# Altium schematic sheet MF-CI.4.2-SDW - EXTERNAL.SchDoc
size A3; Organization: Altium Limited; Address1: L3, 12a Rodborough Rd; Address2: Frenchs Forest; Address3: NSW; Address4: Australia 2086; DocumentNumber: 1; SheetNumber: 1; SheetTotal: 1
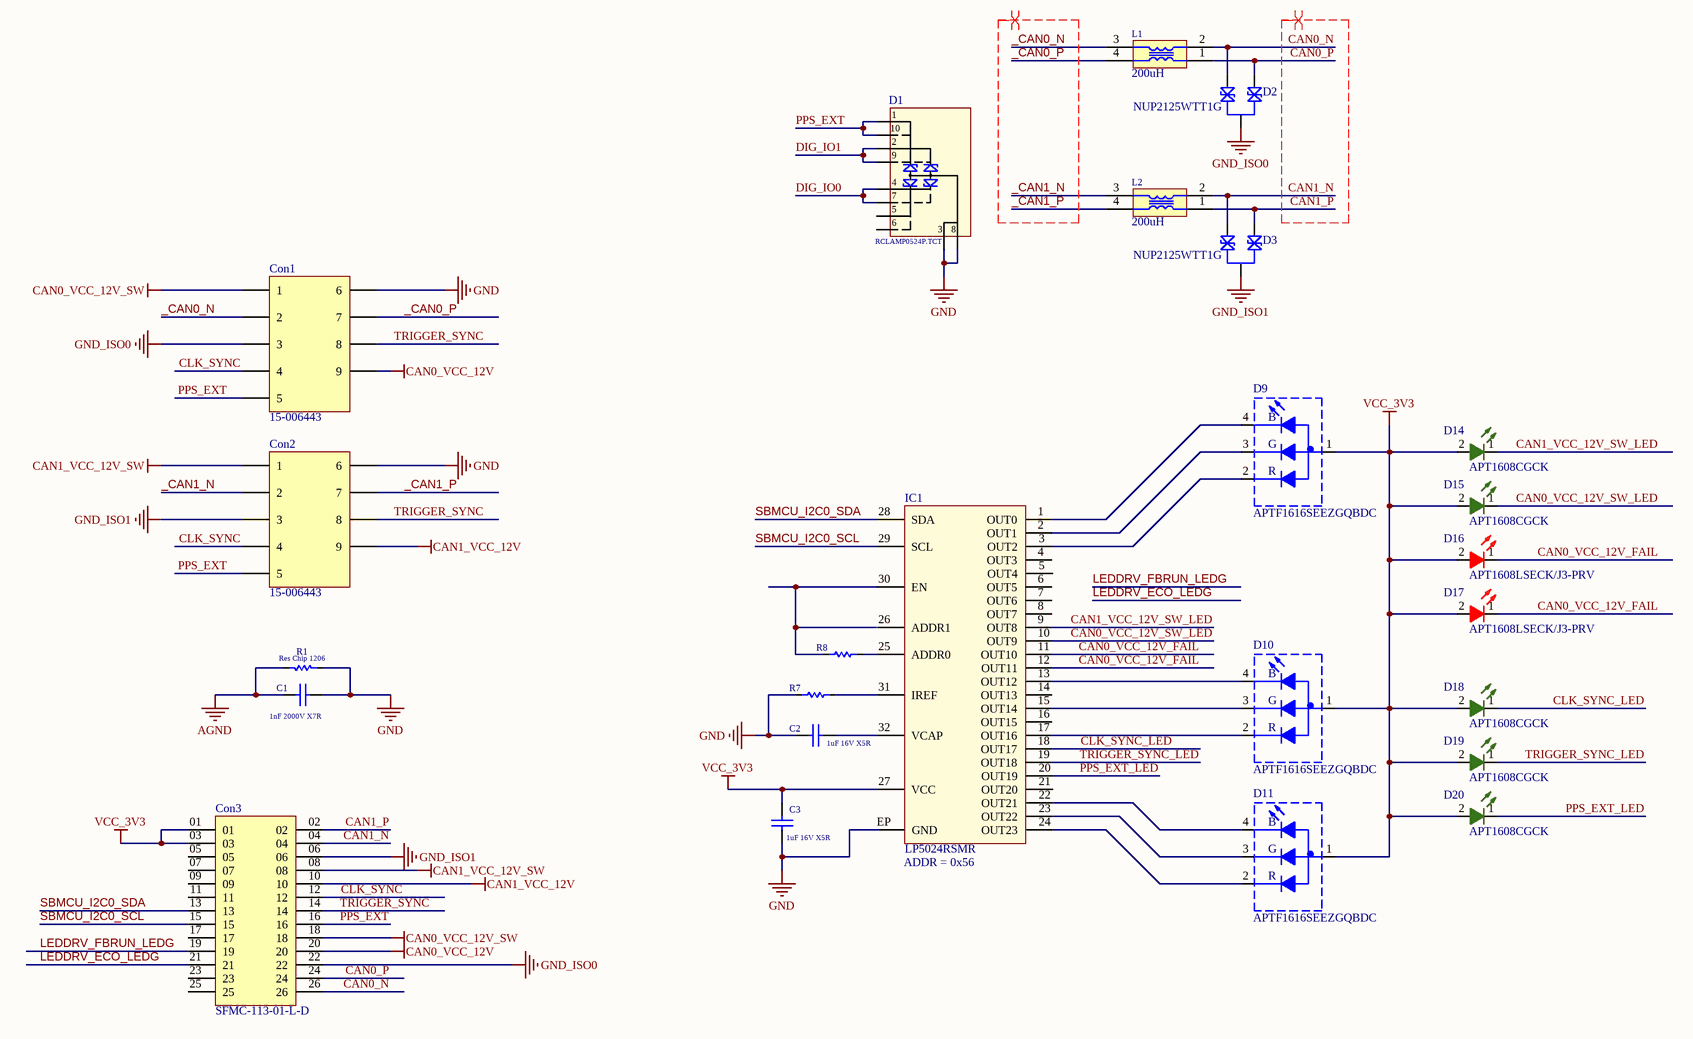
[diagram p0: MF-CI.4.2-SDW - EXTERNAL.SchDoc]

## Parts
C1  1nF 2000V X7R  [1206]
C2  1uF 16V X5R  [0402]
C3  1uF 16V X5R  [0402]
Con1  15-006443  [DSUB-9 Male D, 2.74]
Con2  15-006443  [DSUB-9 Male D, 2.74]
Con3  SFMC-113-01-L-D  [SAMTEC_SFMC-113-01-L-D]
D1  RCLAMP0524P.TCT  [SLP2510P8]
D2  NUP2125WTT1G  [SOT323-3L(SC-70)]
D3  NUP2125WTT1G  [SOT323-3L(SC-70)]
D9  APTF1616SEEZGQBDC  [KINGBRIGHT_APTF1616SEEZGQBDC]
D10  APTF1616SEEZGQBDC  [KINGBRIGHT_APTF1616SEEZGQBDC]
D11  APTF1616SEEZGQBDC  [KINGBRIGHT_APTF1616SEEZGQBDC]
D14  APT1608CGCK  [APT1608CGCK]
D15  APT1608CGCK  [APT1608CGCK]
D16  APT1608LSECK/J3-PRV  [Kingbright_APT1608LSECK/J3-PRV]
D17  APT1608LSECK/J3-PRV  [Kingbright_APT1608LSECK/J3-PRV]
D18  APT1608CGCK  [APT1608CGCK]
D19  APT1608CGCK  [APT1608CGCK]
D20  APT1608CGCK  [APT1608CGCK]
IC1  LP5024RSMR  [QFN-32[8x8]_0,25/0,50_5x5x1_HD[2,10x2,10]]
L1  200uH  [ACT1210L]
L2  200uH  [ACT1210L]
R1  Res Chip 1206  [1206]
R7  Res Chip 0402  [0402]  (value not drawn)
R8  Res Chip 0402  [0402]  (value not drawn)

## Nets
AGND: C1.1 R1.2
CAN0_VCC_12V: Con1.9 Con3.20
CAN0_VCC_12V_SW: Con1.1 Con3.18
CAN1_VCC_12V: Con2.9 Con3.10
CAN1_VCC_12V_SW: Con2.1 Con3.08
GND: C1.2 C2.2 C3.1 Con1.6 Con2.6 D1.3 D1.8 IC1.EP(GND) R1.1 R7.2
GND_ISO0: Con1.3 Con3.22 D2.3
GND_ISO1: Con2.3 Con3.06 D3.3
VCC_3V3: C3.2 Con3.01 Con3.03 D9.1(A) D10.1(A) D11.1(A) D14.2(A) D15.2(A) D16.2(A) D17.2(A) D18.2(A) D19.2(A) D20.2(A) IC1.27(VCC)
_CAN0_N: Con1.2 L1.3
_CAN0_P: Con1.7 L1.4
_CAN1_N: Con2.2 L2.3
_CAN1_P: Con2.7 L2.4
CAN0_N: Con3.26 D2.1 L1.2
CAN0_P: Con3.24 D2.2 L1.1
CAN0_VCC_12V_FAIL: D16.1(K) D17.1(K) IC1.11(OUT10) IC1.12(OUT11)
CAN0_VCC_12V_SW_LED: D15.1(K) IC1.10(OUT9)
CAN1_N: Con3.04 D3.1 L2.2
CAN1_P: Con3.02 D3.2 L2.1
CAN1_VCC_12V_SW_LED: D14.1(K) IC1.9(OUT8)
CLK_SYNC: Con1.4 Con2.4 Con3.12
CLK_SYNC_LED: D18.1(K) IC1.18(OUT17)
DIG_IO0: D1.4 D1.7
DIG_IO1: D1.2 D1.9
LEDDRV_ECO_LEDG: Con3.21
LEDDRV_FBRUN_LEDG: Con3.19
PPS_EXT: Con1.5 Con2.5 Con3.16 D1.1 D1.10
PPS_EXT_LED: D20.1(K) IC1.20(OUT19)
SBMCU_I2C0_SCL: Con3.15 IC1.29(SCL)
SBMCU_I2C0_SDA: Con3.13 IC1.28(SDA)
TRIGGER_SYNC: Con1.8 Con2.8 Con3.14
TRIGGER_SYNC_LED: D19.1(K) IC1.19(OUT18)
NetC2_1: C2.1 IC1.32(VCAP)
NetD9_2: D9.2(K) IC1.3(OUT2)
NetD9_3: D9.3(K) IC1.2(OUT1)
NetD9_4: D9.4(K) IC1.1(OUT0)
NetD10_2: D10.2(K) IC1.17(OUT16)
NetD10_3: D10.3(K) IC1.15(OUT14)
NetD10_4: D10.4(K) IC1.13(OUT12)
NetD11_2: D11.2(K) IC1.24(OUT23)
NetD11_3: D11.3(K) IC1.23(OUT22)
NetD11_4: D11.4(K) IC1.22(OUT21)
NetIC1_25: IC1.25(ADDR0) R8.2
NetIC1_30: IC1.30(EN) R8.1
NetIC1_31: IC1.31(IREF) R7.1

Not connected (* = marked no-connect by the designer): Con3 05 07 09 11 17 23 25; D1 5 6; IC1 4(OUT3) 5(OUT4) 6(OUT5) 7(OUT6) 8(OUT7) 14(OUT13) 16(OUT15) 21(OUT20) 26(ADDR1)

## Layout directives
differential pair: _CAN0_N, _CAN0_P, _CAN1_N, _CAN1_P, CAN0_N, CAN0_P, CAN1_N, CAN1_P

## Notes on the sheet
- (near IC1) ADDR = 0x56
- Project title
- Title
- Variant
- Drawn:
- Checked:
- Approved:
- Size:
- Date:
- SKU
- A3
- Number:
- Time:
- Revision:
- Sheet
- of
- File:
- (in symbol APTF1616SEEZGQBDC) B; G; .; R

## Library data of the parts
C1 = CMP-CAP-002157: Cap Chip 1nF 2000V X7R 1206; Manufact_1: AVX Corporation; Manufact_Part_Nr_1: 1206GC102KAT2A; Type: MLCC; DesignID: CMP-CAP-002157; Value: 1nF; Parameter: X7R; Voltage_Rating: 2000V; Status: OK
C2 C3 = CC0402KRX5R7BB105: Capacitor, 1u, 16V, 10%, X5R, 0402
Con1 Con2 = 15-006443: Conn, D-Sub, Male, 9, 2mm, Str, -40/+105
Con3 = SFMC-113-01-L-D: Conn, Receptacle, Female, 13x2, 1.27mm, Vertical, -55/+125; Manufact_1: Samtec
D1 = CMP-SEM-000069: Diode array TVS, RCLAMP0524P.TCT
D2 D3 = CMP-SEM-000151: Diode dual TVS, SOT323, bidrectional, CAN-FD; Manufact_1: ON Semiconductor; Type: TVS Bidirectional; Parameter: 200W; Voltage_Rating: 24V; Supplier 1: Digi-Key; Supplier Part Number 1: NUP2125WTT1GOSCT-ND; DesignID: CMP-SEM-000151; Manufact_Part_Nr_1: NUP2125WTT1G
D9-D11 = APTF1616SEEZGQBDC: Diode, LED, Red/Green/Blue, 5V, 20mA, -40/+85; Manufact_1: Kingbright
D14 D15 D18-D20 = APT1608CGCK: Diode, LED, Green, 5V, 20mA, Vertical, -40/+85, 0603
D16 D17 = APT1608LSECK/J3-PRV: Diode, LED, Red, 5V, 20mA, -40/+85; Manufact_1: Kignbright
IC1 = LP5024RSMR: IC, LED Driver, 24 LEDs, 2.7-5.5V, 35mA, -40/+85, VFQFN-32; Manufacturer: TI; Manufacturer_Part_Number: LP5024RSMR
L1 L2 = CMP-IND-001114: ACT1210L-201-2P-TL00 -  Filter Common Mode ACT1210L Series 200uH 70mA 2.5mm x 3.9mm x 2.5mm; Manufact_1: TDK; Type: Common Mode Choke; Parameter: 0.07A; Voltage_Rating: 80V; Value: 200uH; Dummy_PN: ACT1210L-201-2P-TL00; Supplier 1: Digi-Key; Supplier Part Number 1: 445-174934-1-ND; DesignID: CMP-IND-001114; Manufact_Part_Nr_1: ACT1210L-201-2P-TL00; Status: OK
R1 = CMP-RST-001901
R7 R8 = CMP-RST-001998